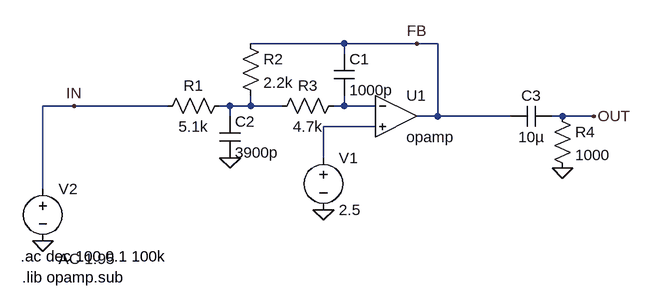
[diagram p0: schematic Draft1.asc]
Draft1.asc, the LTspice schematic file:
Version 4
SHEET 1 880 680
WIRE 128 0 -16 0
WIRE 240 0 128 0
WIRE 272 0 240 0
WIRE 128 16 128 0
WIRE -288 96 -336 96
WIRE -144 96 -288 96
WIRE -48 96 -64 96
WIRE -16 96 -16 80
WIRE -16 96 -48 96
WIRE 32 96 -16 96
WIRE 128 96 128 80
WIRE 128 96 112 96
WIRE 176 96 128 96
WIRE -48 112 -48 96
WIRE 272 112 272 0
WIRE 272 112 240 112
WIRE 384 112 272 112
WIRE 464 112 448 112
WIRE 512 112 464 112
WIRE 176 128 96 128
WIRE 96 176 96 128
WIRE -336 224 -336 96
FLAG 96 256 0
FLAG 512 112 OUT
FLAG -48 176 0
FLAG -336 304 0
FLAG 240 0 FB
FLAG -288 96 IN
FLAG 464 192 0
SYMBOL voltage 96 160 R0
SYMATTR InstName V1
SYMATTR Value 2.5
SYMBOL cap 448 96 R90
WINDOW 0 0 32 VBottom 2
WINDOW 3 32 32 VTop 2
SYMATTR InstName C3
SYMATTR Value 10µ
SYMBOL cap 112 16 R0
SYMATTR InstName C1
SYMATTR Value 1000p
SYMBOL res -32 -16 R0
SYMATTR InstName R2
SYMATTR Value 2.2k
SYMBOL res 128 80 R90
WINDOW 0 0 56 VBottom 2
WINDOW 3 32 56 VTop 2
SYMATTR InstName R3
SYMATTR Value 4.7k
SYMBOL res -48 80 R90
WINDOW 0 0 56 VBottom 2
WINDOW 3 32 56 VTop 2
SYMATTR InstName R1
SYMATTR Value 5.1k
SYMBOL cap -64 112 R0
SYMATTR InstName C2
SYMATTR Value 3900p
SYMBOL voltage -336 208 R0
WINDOW 123 24 124 Left 2
WINDOW 39 0 0 Left 0
SYMATTR InstName V2
SYMATTR Value ""
SYMATTR Value2 AC 1.95
SYMBOL OpAmps\\opamp 208 48 R0
SYMATTR InstName U1
SYMBOL res 448 96 R0
SYMATTR InstName R4
SYMATTR Value 1000
TEXT -370 328 Left 2 !.ac dec 100 0.1 100k
TEXT -368 360 Left 2 !.lib opamp.sub

The netlist it stands for:
* Draft1.asc
V1 N003 0 2.5
C3 OUT FB 10µ
C1 FB N002 1000p
R2 FB N001 2.2k
R3 N002 N001 4.7k
R1 N001 IN 5.1k
C2 N001 0 3900p
V2 IN 0 AC 1.95
XU1 N002 N003 FB opamp Aol=100K GBW=10Meg  ; pins invin noninvin out
R4 OUT 0 1000
.ac dec 100 0.1 100k
.lib opamp.sub
.backanno
.end

* Results of the author's LTspice run, read from the files saved beside the schematic
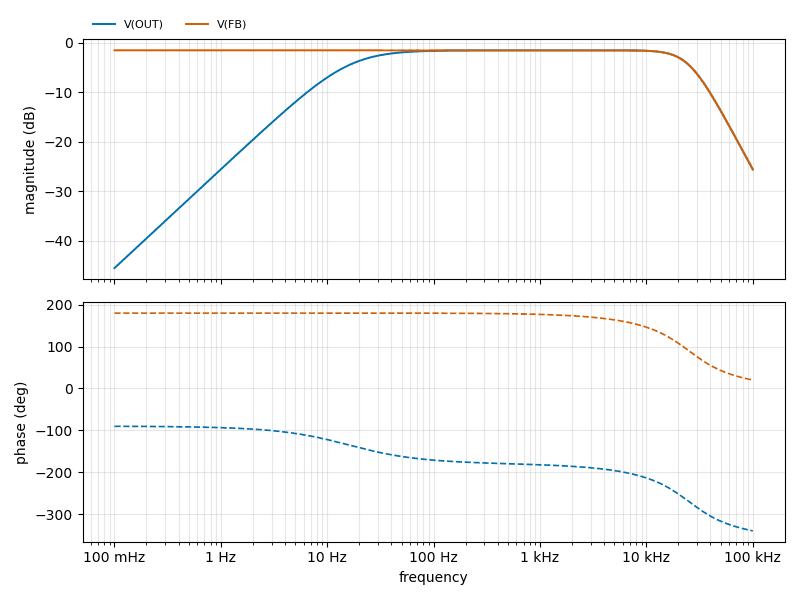
[diagram p1: AC Analysis of Draft1.asc, plotted from the saved traces]
* AC Analysis, 1 run:
*   V(OUT): -45.54 dB at 100 mHz, -25.58 dB at 100 kHz, peak -1.50 dB at 3.02 kHz, 3 dB below the peak at 15.92 Hz and 25.19 kHz
*   V(FB): -1.50 dB at 100 mHz, -25.58 dB at 100 kHz, peak -1.50 dB at 2.951 kHz, 3 dB below the peak at 25.19 kHz